# EAGLE design leddriver (EAGLE 8.2.0)
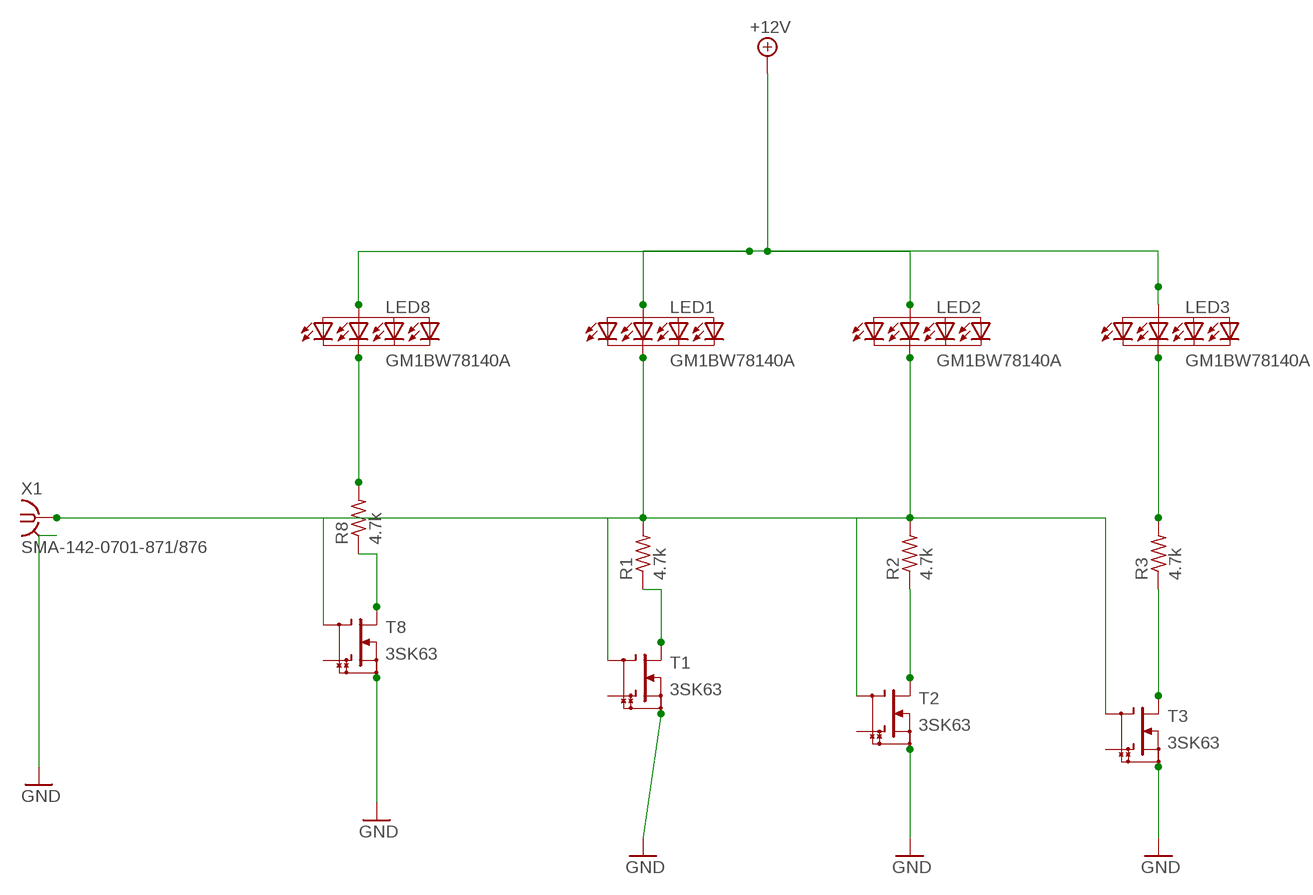
[diagram p0: schematic, sheet 1]

## Parts
LED1  GM1BW78140A  [GM1BW78140A]
LED2  GM1BW78140A  [GM1BW78140A]
LED3  GM1BW78140A  [GM1BW78140A]
LED8  GM1BW78140A  [GM1BW78140A]
R1  4.7k  R-US_0207/5V  [0207/5V]
R2  4.7k  R-US_0207/5V  [0207/5V]
R3  4.7k  R-US_0207/5V  [0207/5V]
R8  4.7k  R-US_0207/5V  [0207/5V]
T1  3SK63  [TO72]
T2  3SK63  [TO72]
T3  3SK63  [TO72]
T8  3SK63  [TO72]
X1  SMA-142-0701-871/876  [J502-ND-142-0701-871/876]

## Nets
+12V: LED1.A LED2.A LED3.A LED8.A
GND: T1.4(SOURCE) T2.4(SOURCE) T3.4(SOURCE) T8.4(SOURCE) X1.G@1 X1.G@2 X1.G@3 X1.G@4
N$1: R8.1 T8.1(DRAIN)
N$2: R1.1 T1.1(DRAIN)
N$3: LED8.C R8.2
N$4: R2.1 T2.1(DRAIN)
N$5: LED1.C R1.2
N$6: R3.1 T3.1(DRAIN)
N$7: LED2.C R2.2
N$8: T1.3(G1) T2.3(G1) T3.3(G1) T8.3(G1) X1.1
N$9: LED3.C R3.2
Unconnected: T1.2(G2) T2.2(G2) T3.2(G2) T8.2(G2)

## Library data of the parts
LED1-LED3 LED8 = led:GM1BW78140A: High Brightness Chip LED (White) 39 lm @ 150 mA Source: http://document.sharpsma.com/files/GM1BW78140A.pdf
R1-R3 R8 = resistor:R-US_: RESISTOR, American symbol
T1-T3 T8 = transistor:3SK63: N CHANNEL Dual Gate MOS FET VHF Amplifier Source: 3SK59.pdf
X1 = con-coax:SMA-: SMA 50 Ohm End Launch Jack Receptacle - Round Contact Johnson Components Source: www.johnsoncomponents.com .. J502-ND.pdf; MF: JOHNSON COMPONENTS; MPN: 142-0701-871; OC_FARNELL: 1339835; OC_NEWARK: 91B6105

## Board
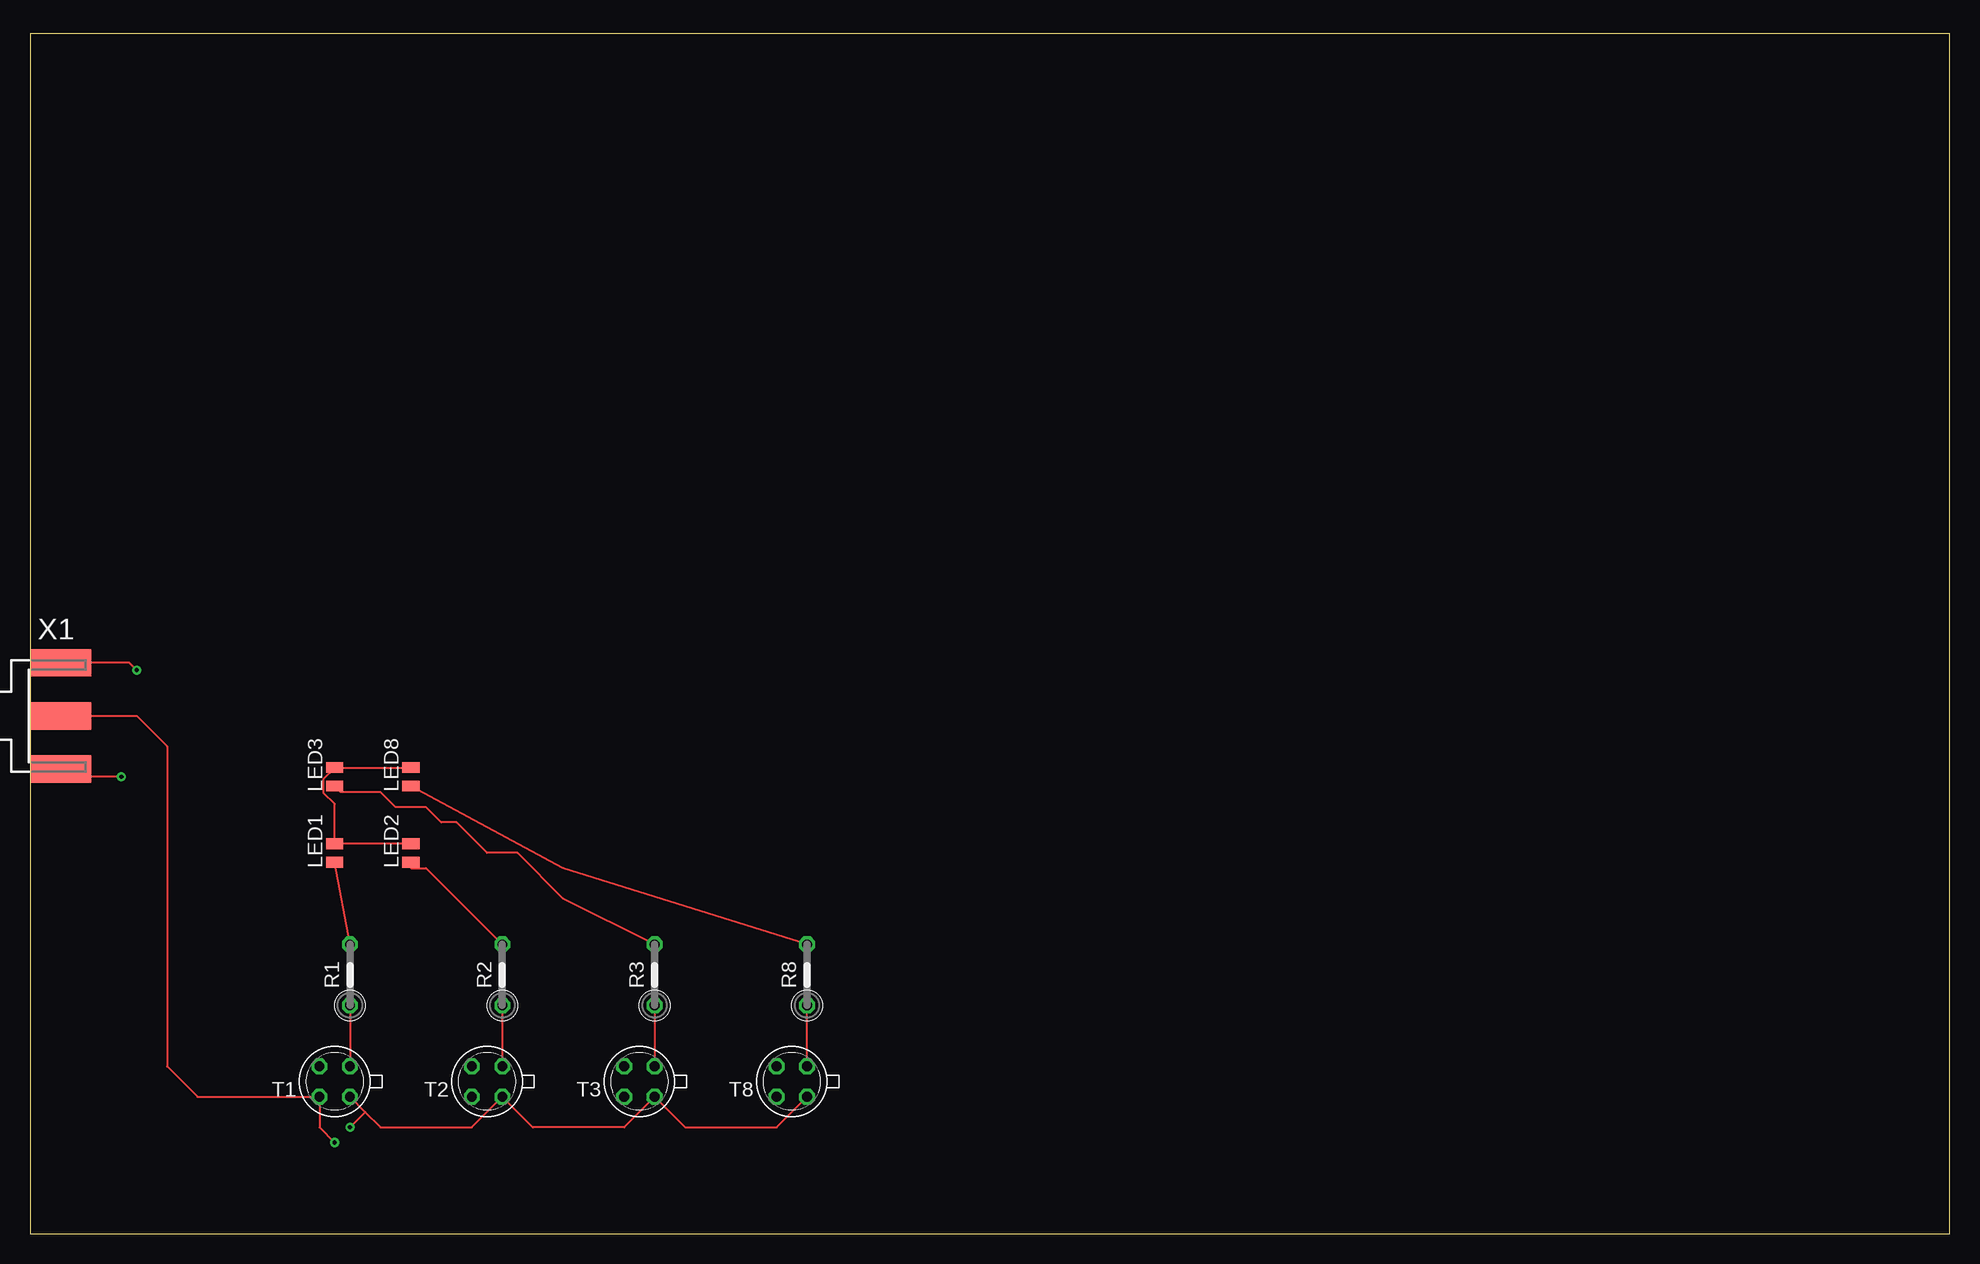
[diagram p1: board, top side]
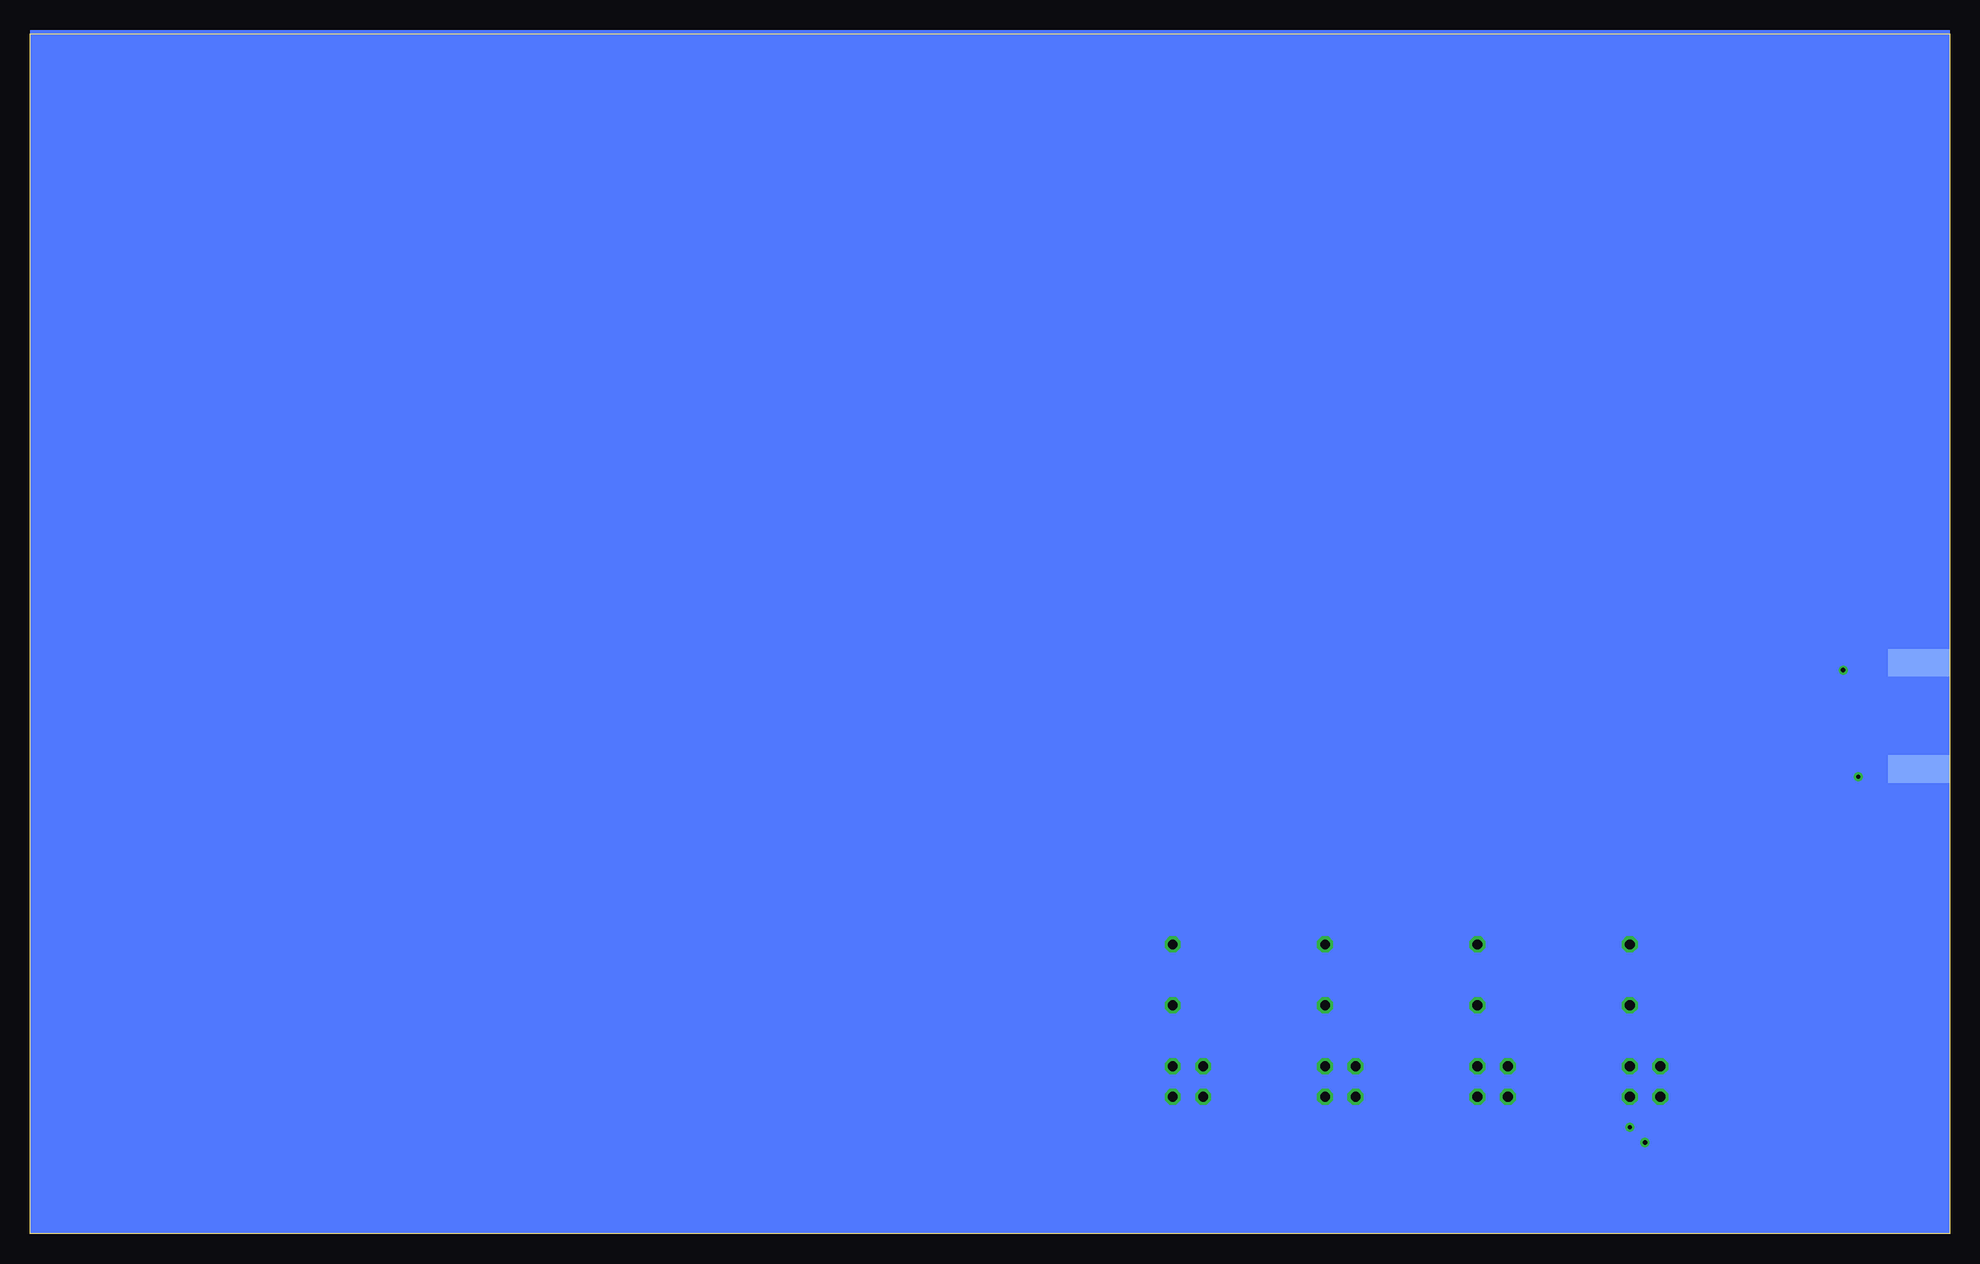
[diagram p2: board, bottom side, seen from below]

Size 160 x 100 mm. Coordinates in mm from the lower left corner, seen from the top.
Outline: 0,0 160,0 160,100 0,100 0,0
Copper layers (1*16): Top 0.035mm / dielectric 1.5mm / Bottom 0.035mm
Design rules "default": minimum track width 6mil, minimum drill 0.35mm, track to track 6mil, track to pad 6mil, pad to pad 6mil, via to via 6mil, smd to smd 6mil, copper to edge 40mil, drill to drill 6mil, minimum pad ring 10mil, minimum via ring 8mil, stop-mask expansion 4mil, vias tented up to drill 0mil, thermal gap 10mil

### Footprints (pad centres in the part's own frame; a part is rotated, then mirrored left to right if it is on the bottom)
GM1BW78140A = smd 0.9 x 1.44: A 0.77,0; C -0.77,0
0207/5V = drill 0.813 octagon: 1 -2.54,0; 2 2.54,0
TO72 = drill 0.813 octagon: 1 -1.27,-1.27; 2 1.27,-1.27; 3 1.27,1.27; 4 -1.27,1.27
J502-ND-142-0701-871/876 = smd 5.08 x 2.286: 1 2.565,0; G@1 2.565,4.42; G@2 2.565,-4.42 | smd 5.08 x 2.286 bottom: G@3 2.565,4.42; G@4 2.565,-4.42

### Placement (x,y rotation side)
LED1  25.4,31.75 90 top
LED2  31.75,31.75 90 top
LED3  25.4,38.1 90 top
LED8  31.75,38.1 90 top
R1  26.67,21.59 90 top
R2  39.37,21.59 90 top
R3  52.07,21.59 90 top
R8  64.77,21.59 90 top
T1  25.4,12.7 180 top
T2  38.1,12.7 180 top
T3  50.8,12.7 180 top
T8  63.5,12.7 180 top
X1  0,43.18 0 top

### Tracks (layer width: path | path; a pad name or v marks a point on that pad's centre or on a via)
+12V
  Top 0.152: LED8.A LED3.A 25.4,38.82 24.45,37.88 24.45,36.78 25.4,35.84 LED1.A LED2.A
GND  (via drill 0.35)
  Top 0.152: T8.4 62.23,8.89 54.61,8.89 T3.4 49.53,8.89 41.91,8.89 T2.4 36.83,8.89 29.21,8.89 27.94,10.16 | 27.94,10.16 T1.4 | v26.67,8.89 27.94,10.16 | X1.G@3 8.28,47.6 v8.89,46.99 | v7.62,38.1 2.54,38.1 2.54,38.73 X1.G@4
  Bottom 0.152: v8.89,46.99 10.16,41.91 10.16,39.37 | 10.16,39.37 10.16,12.7 12.7,10.16 21.59,10.16 22.86,8.89 v26.67,8.89 | 5.08,39.37 4.47,38.76 X1.G@4 7.01,38.76 7.62,39.37 | 10.16,39.37 7.62,39.37 | X1.G@3 4.47,47.6 7.62,44.45 7.62,39.37 | 7.62,39.37 v7.62,38.1
N$1
  Top 0.152: T8.1 R8.1
N$2
  Top 0.152: R1.1 T1.1
N$3
  Top 0.152: R8.2 44.45,30.48 LED8.C
N$4
  Top 0.152: R2.1 T2.1
N$5
  Top 0.152: R1.2 LED1.C
N$6
  Top 0.152: R3.1 T3.1
N$7
  Top 0.152: R2.2 33.02,30.48 31.75,30.48 LED2.C
N$8  (via drill 0.35)
  Top 0.152: v25.4,7.62 24.13,8.89 T1.3 13.97,11.43 11.43,13.97 11.43,40.64 8.89,43.18 X1.1
  Bottom 0.152: v25.4,7.62 26.67,7.62 30.48,11.43 T2.3 39.37,8.89 41.91,8.89 43.18,10.16 48.26,10.16 T3.3 52.07,8.89 53.34,8.89 54.61,10.16 60.96,10.16 T8.3
N$9
  Top 0.152: R3.2 44.45,27.94 40.64,31.75 38.1,31.75 35.56,34.29 34.29,34.29 33.02,35.56 30.48,35.56 29.21,36.83 25.9,36.83 LED3.C
(copper drawn outside any net)
  shapes: Bottom area x1